# EAGLE board oresat-batteries (EAGLE 9.6.2), part 1 of 2
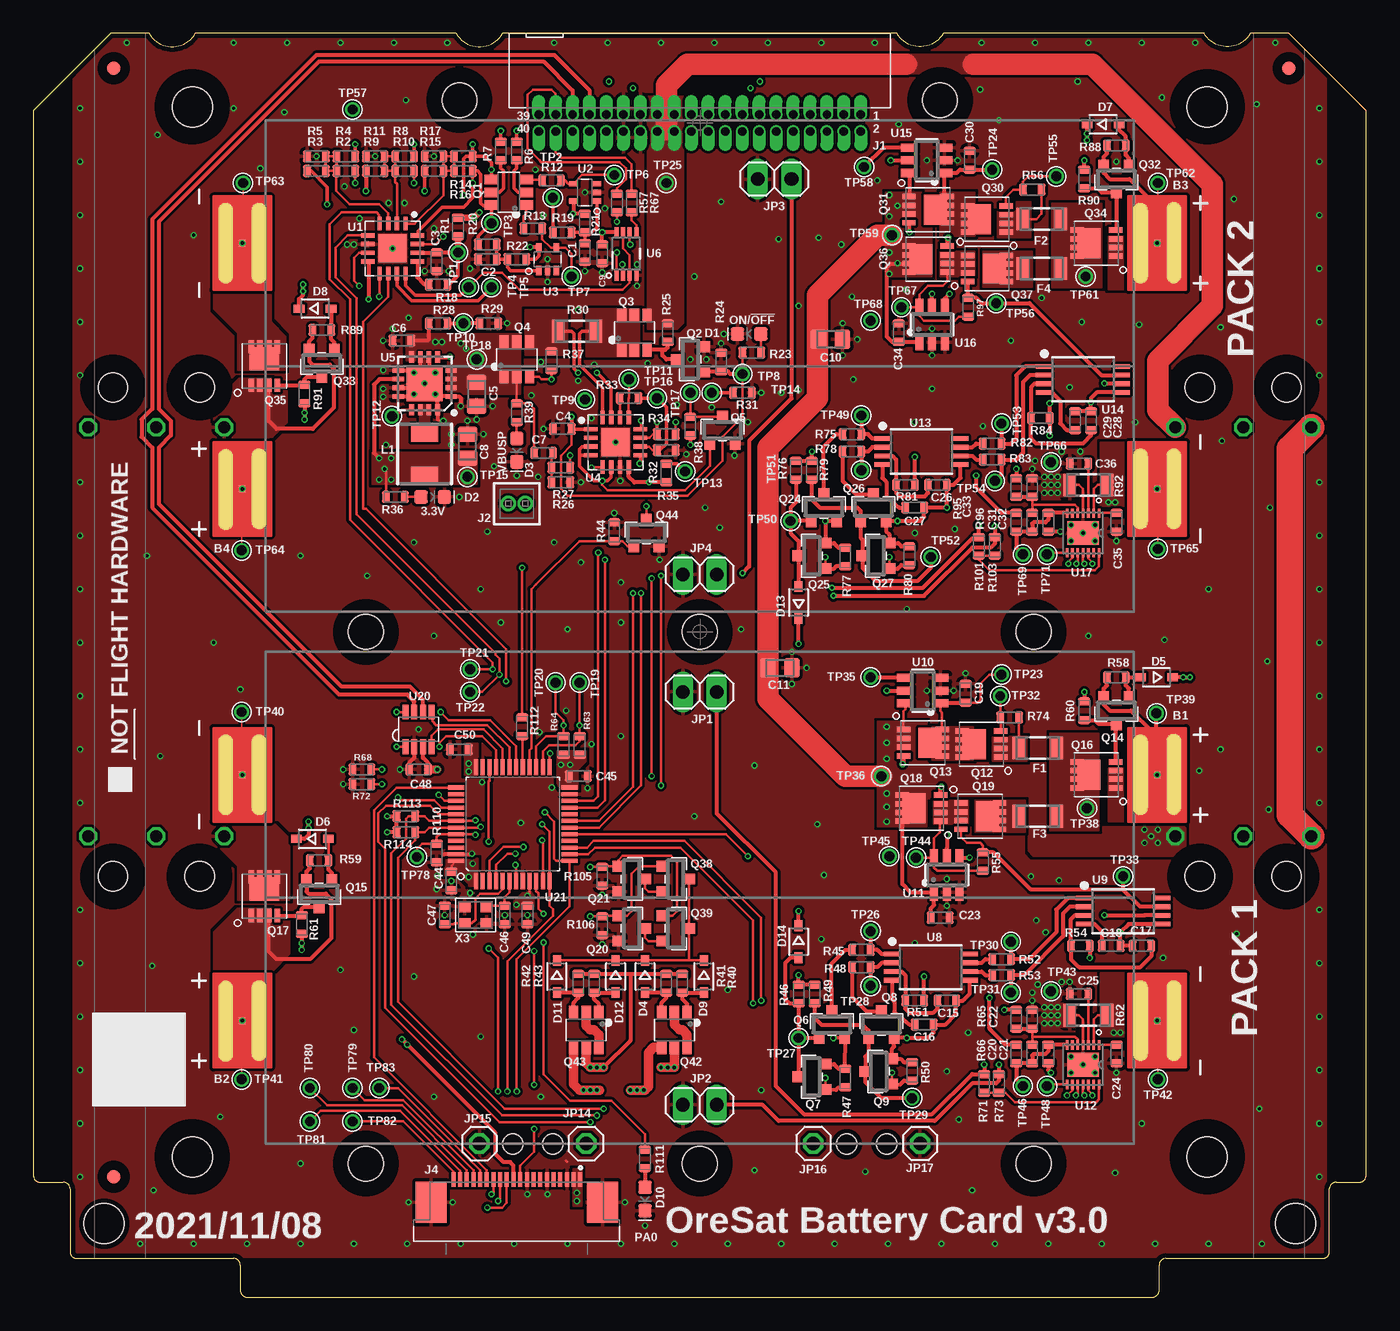
[diagram p5: board, top side]
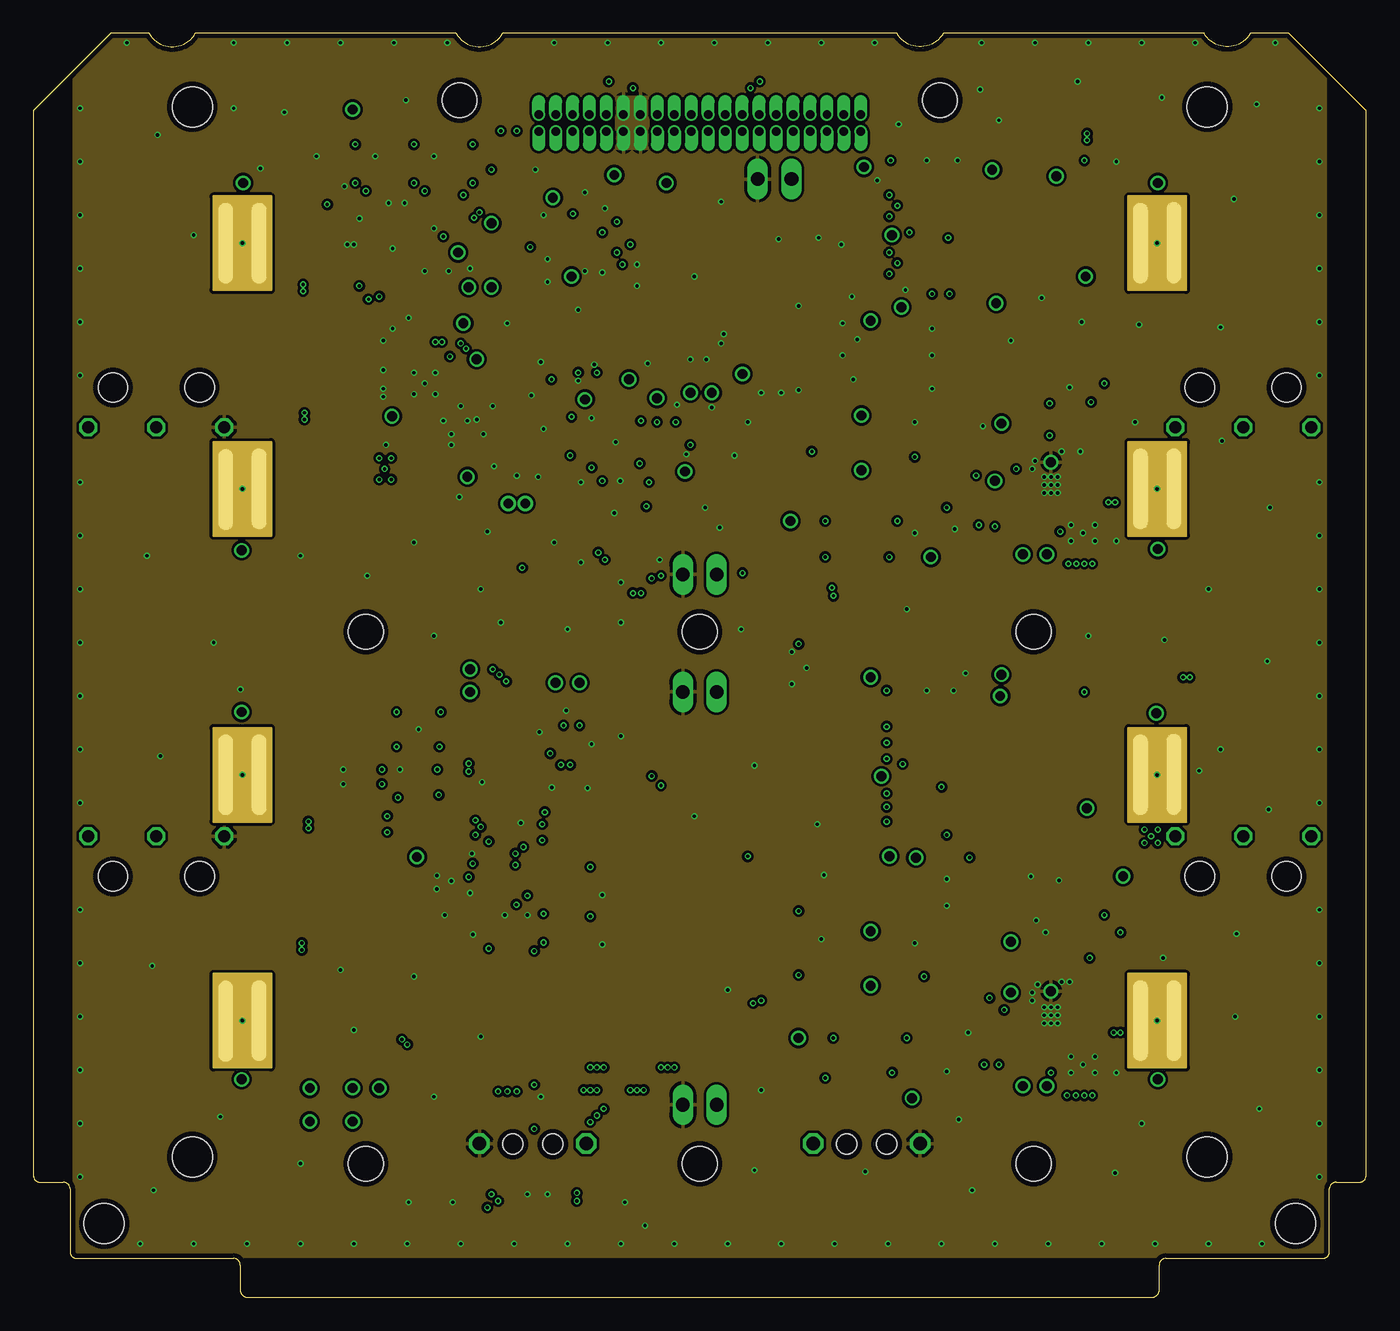
[diagram p6: board, inner layer Route2]
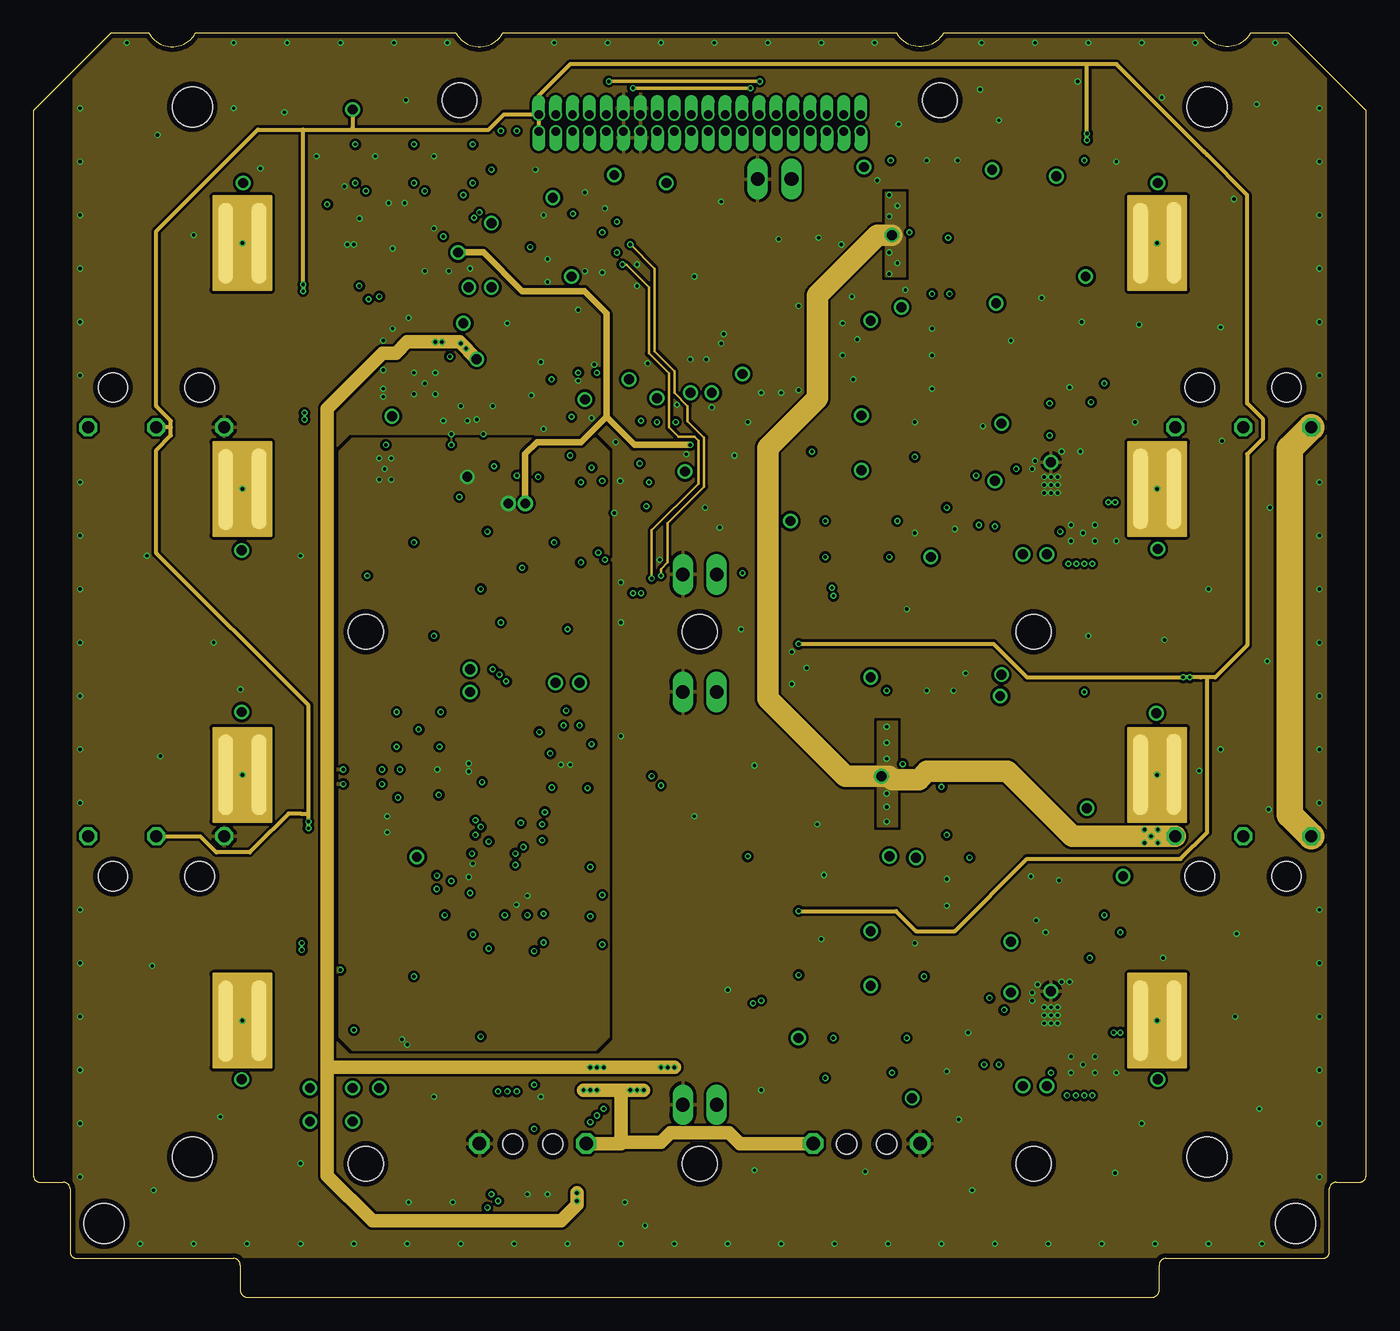
[diagram p7: board, inner layer route15]
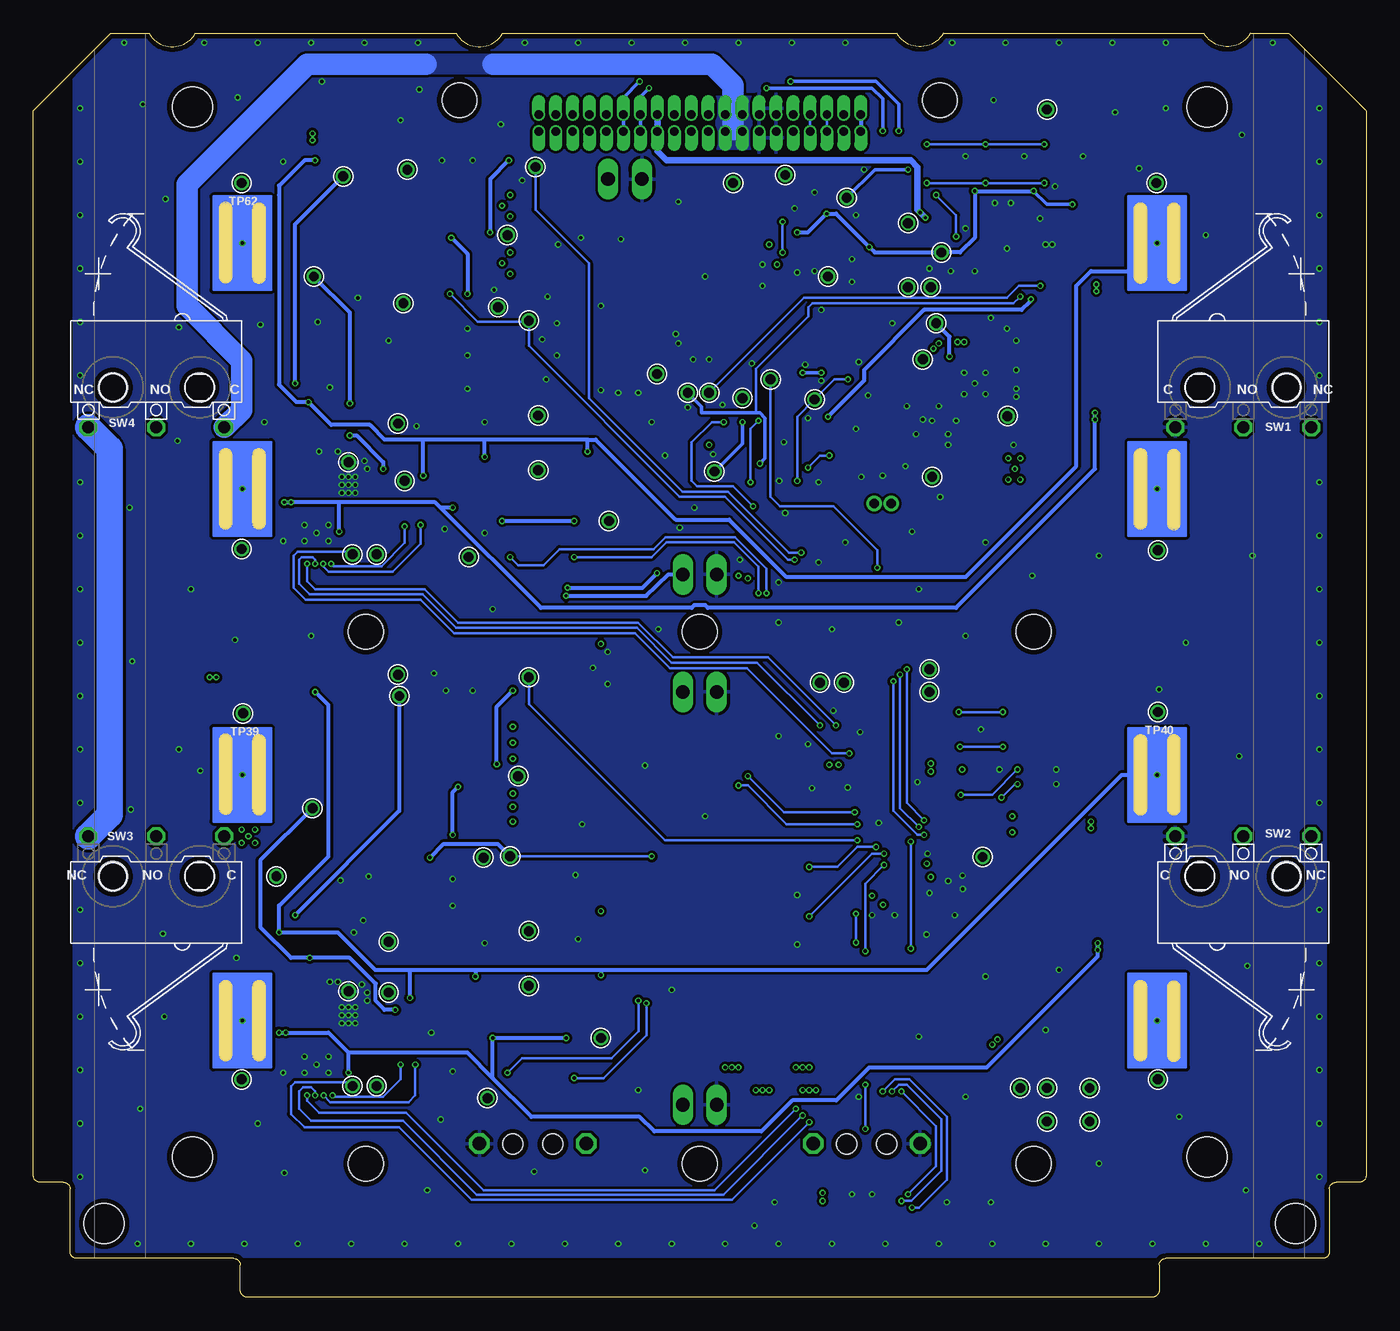
[diagram p8: board, bottom side, seen from below]

Size 99.8 x 94.6 mm. Coordinates in mm from the lower left corner, seen from the top.
Copper layers (1*2*15*16): Top 0.035559375mm / dielectric 0.17018125mm / Route2 0.01778125mm / dielectric 47mil / route15 0.01778125mm / dielectric 0.17018125mm / Bottom 0.035559375mm
Design rules "oshpark-4layer *": minimum track width 5mil, minimum drill 10mil, track to track 5mil, track to pad 5mil, pad to pad 5mil, via to via 5mil, smd to smd 5mil, copper to edge 15mil, drill to drill 6mil, minimum pad ring 4mil, minimum via ring 4mil, stop-mask expansion 2.5mil, vias tented up to drill 10mil, thermal gap 10mil
Net classes: 1 SHUTDOWN: clearance 0.2 mm; 2 BATTERY: clearance 0.2 mm
tRestrict: 8 lines

## Footprints (pad centres in the part's own frame; a part is rotated, then mirrored left to right if it is on the bottom)
18650 = smd 0.5 x 0.5: NEG-T 0,-34.25; POS-T 0,34.25
.0603-C-NOSILK = smd 0.6 x 0.9: 1 -0.7,0; 2 0.7,0
.0805-B-NOSILK = smd 1.15 x 1.45: 1 -0.9,0; 2 0.9,0
LED-0603 = smd 1 x 1: A -0.877,0; C 0.877,0
SOD323-R = smd 0.8 x 0.6: A 1.2,0; C -1.2,0
1206-C = smd 0.95 x 1.7: 1 -1.4,0; 2 1.4,0
FIDUCIAL-1.0X2.0 = smd 1 x 1: FIDUCIAL 0,0
J-SAMTEC-TFM-120-X1-XXX-D-RA = drill 0.635 pad 0.965 offset: 1 12.065,0.635; 2 12.065,-0.635; 3 10.795,0.635; 4 10.795,-0.635; 5 9.525,0.635; 6 9.525,-0.635; 7 8.255,0.635; 8 8.255,-0.635; 9 6.985,0.635; 10 6.985,-0.635; 11 5.715,0.635; 12 5.715,-0.635; 13 4.445,0.635; 14 4.445,-0.635; 15 3.175,0.635; 16 3.175,-0.635; 17 1.905,0.635; 18 1.905,-0.635; 19 0.635,0.635; 20 0.635,-0.635; 21 -0.635,0.635; 22 -0.635,-0.635; 23 -1.905,0.635; 24 -1.905,-0.635; 25 -3.175,0.635; 26 -3.175,-0.635; 27 -4.445,0.635; 28 -4.445,-0.635; 29 -5.715,0.635; 30 -5.715,-0.635; 31 -6.985,0.635; 32 -6.985,-0.635; 33 -8.255,0.635; 34 -8.255,-0.635; 35 -9.525,0.635; 36 -9.525,-0.635; 37 -10.795,0.635; 38 -10.795,-0.635; 39 -12.065,0.635; 40 -12.065,-0.635
SAMTEC-FTS-102-01-X-S = drill 0.71 pad 1.143: 1 -0.635,0; 2 0.635,0
TE_2-1734592-0 = smd 0.3 x 1.1: 1 -4.75,-1.7; 2 -4.25,-1.7; 3 -3.75,-1.7; 4 -3.25,-1.7; 5 -2.75,-1.7; 6 -2.25,-1.7; 7 -1.75,-1.7; 8 -1.25,-1.7; 9 -0.75,-1.7; 10 -0.25,-1.7; 11 0.25,-1.7; 12 0.75,-1.7; 13 1.25,-1.7; 14 1.75,-1.7; 15 2.25,-1.7; 16 2.75,-1.7; 17 3.25,-1.7; 18 3.75,-1.7; 19 4.25,-1.7; 20 4.75,-1.7 | smd 2.3 x 3.1: PAD1 6.42,0; PAD2 -6.42,0
1X02 = drill 1.016 long: 1 -1.27,0; 2 1.27,0
1X01 = drill 1.016 octagon: 1 0,0
ECS-MPI4040 = smd 2 x 1.3: 1 0,1.575; 2 0,-1.575
SOT23-6 = smd 0.7 x 1: 1 -0.95,-1.3; 2 0,-1.3; 3 0.95,-1.3; 4 0.95,1.3; 5 0,1.3; 6 -0.95,1.3
SOT23-3 = smd 0.8 x 0.9: 1 -0.95,-1; 2 0.95,-1; 3 0,1
POWERPAK-1212-8 = smd 0.41 x 1: 1 -0.975,-1.44; 2 -0.325,-1.44; 3 0.325,-1.44; 4 0.975,-1.44; 5 -0.975,1.44; 6 -0.325,1.44; 7 0.325,1.44; 8 0.975,1.44 | smd 2.24 x 1.73: PAD 0,0.55
D2F-L3-D-HORIZONTAL-L = drill 0.9 octagon: C -5.1,-3; NC 5.1,-3; NO 0,-3 | hole 2.2: 3.25,0; -3.25,0
D2F-L3-D-HORIZONTAL-R = drill 0.9 octagon: C 5.1,-3; NC -5.1,-3; NO 0,-3 | hole 2.2: 3.25,0; -3.25,0
1X01' = drill 0.737 pad 1.1: 1 0,0
QFN65P400X400X80-17T210 = smd 1.01 x 0.32: 1 -1.86,0.975; 2 -1.86,0.325; 3 -1.86,-0.325; 4 -1.86,-0.975; 9 1.86,-0.975; 10 1.86,-0.325; 11 1.86,0.325; 12 1.86,0.975 | smd 0.32 x 1.01: 5 -0.975,-1.86; 6 -0.325,-1.86; 7 0.325,-1.86; 8 0.975,-1.86; 13 0.975,1.86; 14 0.325,1.86; 15 -0.325,1.86; 16 -0.975,1.86 | smd 2.1 x 2.1: EPAD 0,0
SC70-5 = smd 0.4 x 0.7: 1 -0.65,-0.85; 2 0,-0.85; 3 0.65,-0.85; 4 0.65,0.85; 5 -0.65,0.85
S-PVQFN-16 = smd 0.85 x 0.35: 1 -1.975,0.975; 2 -1.975,0.325; 3 -1.975,-0.325; 4 -1.975,-0.975; 9 1.975,-0.975; 10 1.975,-0.325; 11 1.975,0.325; 12 1.975,0.975 | smd 0.35 x 0.85: 5 -0.975,-1.975; 6 -0.325,-1.975; 7 0.325,-1.975; 8 0.975,-1.975; 13 0.975,1.975; 14 0.325,1.975; 15 -0.325,1.975; 16 -0.975,1.975 | smd 2.7 x 2.7: PAD 0,0
DCU0008A_N = smd 0.8 x 0.3: 1 -1.6,0.75; 2 -1.6,0.25; 3 -1.6,-0.25; 4 -1.6,-0.75; 5 1.6,-0.75; 6 1.6,-0.25; 7 1.6,0.25; 8 1.6,0.75
TSSOP8 = smd 1.2 x 0.35: 1 -2.925,0.975; 2 -2.925,0.325; 3 -2.925,-0.325; 4 -2.925,-0.975; 5 2.925,-0.975; 6 2.925,-0.325; 7 2.925,0.325; 8 2.925,0.975
SOT23-6' = smd 0.6 x 1.25: 1 0.95,1.31; 2 0,1.31; 3 -0.95,1.31; 4 -0.95,-1.31; 5 0,-1.31; 6 0.95,-1.31
21-0137I_T1433-2 = smd 0.7 x 0.2: 1 -1.475,1.2; 2 -1.475,0.8; 3 -1.475,0.4; 4 -1.475,0; 5 -1.475,-0.4; 6 -1.475,-0.8; 7 -1.475,-1.2; 8 1.475,-1.2; 9 1.475,-0.8; 10 1.475,-0.4; 11 1.475,0; 12 1.475,0.4; 13 1.475,0.8; 14 1.475,1.2 | smd 1.78 x 2.35: EP 0,0
SOT23-8_TI-DCN = smd 0.45 x 1.1: 1 -0.975,-1.3; 2 -0.325,-1.3; 3 0.325,-1.3; 4 0.975,-1.3; 5 0.975,1.3; 6 0.325,1.3; 7 -0.325,1.3; 8 -0.975,1.3
STM32F091C = smd 0.3 x 1.2: 1 -2.75,-4.25; 2 -2.25,-4.25; 3 -1.75,-4.25; 4 -1.25,-4.25; 5 -0.75,-4.25; 6 -0.25,-4.25; 7 0.25,-4.25; 8 0.75,-4.25; 9 1.25,-4.25; 10 1.75,-4.25; 11 2.25,-4.25; 12 2.75,-4.25; 25 2.75,4.25; 26 2.25,4.25; 27 1.75,4.25; 28 1.25,4.25; 29 0.75,4.25; 30 0.25,4.25; 31 -0.25,4.25; 32 -0.75,4.25; 33 -1.25,4.25; 34 -1.75,4.25; 35 -2.25,4.25; 36 -2.75,4.25 | smd 1.2 x 0.3: 13 4.25,-2.75; 14 4.25,-2.25; 15 4.25,-1.75; 16 4.25,-1.25; 17 4.25,-0.75; 18 4.25,-0.25; 19 4.25,0.25; 20 4.25,0.75; 21 4.25,1.25; 22 4.25,1.75; 23 4.25,2.25; 24 4.25,2.75; 37 -4.25,2.75; 38 -4.25,2.25; 39 -4.25,1.75; 40 -4.25,1.25; 41 -4.25,0.75; 42 -4.25,0.25; 43 -4.25,-0.25; 44 -4.25,-0.75; 45 -4.25,-1.25; 46 -4.25,-1.75; 47 -4.25,-2.25; 48 -4.25,-2.75
ORESAT-CARD-V1.3-BATTERY-V3.0 = hole 2.6: 31.9,89.6; 67.9,89.6; 49.9,49.8; 24.9,49.8; 74.9,49.8; 74.9,10; 49.9,10; 24.9,10 | hole 1.5: 35.9,11.45; 38.9,11.45; 60.9,11.45; 63.9,11.45 | hole 3: 94.5,5.5; 5.3,5.5; 87.9,10.5; 87.9,89.1; 11.9,89.1; 11.9,10.5
CRYSTAL_2.5X2 = smd 0.9 x 0.8: 1 -0.825,-0.625; 2 0.825,-0.625; 3 0.825,0.625; 4 -0.825,0.625

## Placement (x,y rotation side)
B1  B-18650-LI-BATTERY  [18650]  49.9,39.1 270 top
B2  B-18650-LI-BATTERY  [18650]  49.9,20.7 90 top
B3  B-18650-LI-BATTERY  [18650]  49.9,78.9 270 top
B4  B-18650-LI-BATTERY  [18650]  49.9,60.5 90 top
C1  1u  [.0603-C-NOSILK]  41.3,78.2 270 top
C2  1u  [.0603-C-NOSILK]  34,77.7 180 top
C3  100n  [.0603-C-NOSILK]  30.2,77.5 90 top
C4  1u  [.0603-C-NOSILK]  39.6,65 180 top
C5  10u  [.0805-B-NOSILK]  33.2,67.6 270 top
C6  1u  [.0603-C-NOSILK]  27.6,71.6 180 top
C7  1u  [.0603-C-NOSILK]  38.2,63.2 180 top
C8  22u  [.0805-B-NOSILK]  32.5,63.7 90 top
C9  100n  [.0603-C-NOSILK]  42.6,78.1 90 top
C10  10u  [.0805-B-NOSILK]  59.7,71.7 0 top
C11  10u  [.0805-B-NOSILK]  55.9,47.1 0 top
C15  100n  [.0603-C-NOSILK]  68.4,22.2 0 top
C16  10n  [.0603-C-NOSILK]  66.7,20.4 0 top
C17  100n  [.0603-C-NOSILK]  83,26.3 180 top
C18  10n  [.0603-C-NOSILK]  80.7,26.3 0 top
C19  100n  [.0603-C-NOSILK]  69.8,45.2 90 top
C20  1n  [.0603-C-NOSILK]  74.8,18.2 270 top
C21  1n  [.0603-C-NOSILK]  76,18.2 270 top
C22  100n  [.0603-C-NOSILK]  74.8,20.8 90 top
C23  100n  [.0603-C-NOSILK]  67.9,28.4 0 top
C24  470n  [.0603-C-NOSILK]  81.1,18.2 270 top
C25  470n  [.0603-C-NOSILK]  78.3,22.7 180 top
C26  100n  [.0603-C-NOSILK]  67.7,60.8 0 top
C27  10n  [.0603-C-NOSILK]  66,59.1 0 top
C28  100n  [.0603-C-NOSILK]  79.2,65.6 90 top
C29  10n  [.0603-C-NOSILK]  78,65.6 90 top
C30  100n  [.0603-C-NOSILK]  70.1,85.1 90 top
C31  1n  [.0603-C-NOSILK]  74.8,58 270 top
C32  1n  [.0603-C-NOSILK]  76,58 270 top
C33  100n  [.0603-C-NOSILK]  74.8,60.6 90 top
C34  100n  [.0603-C-NOSILK]  64.8,72.2 90 top
C35  470n  [.0603-C-NOSILK]  81.1,58 270 top
C36  470n  [.0603-C-NOSILK]  78.3,62.4 180 top
C44  100n  [.0603-C-NOSILK]  31.3,31.15 90 top
C45  100n  [.0603-C-NOSILK]  40.8,39 180 top
C46  20p  [.0603-C-NOSILK]  35.3,28.6 270 top
C47  20p  [.0603-C-NOSILK]  30.8,28.6 90 top
C48  100n  [.0603-C-NOSILK]  28.85,39.5 0 top
C49  100n  [.0603-C-NOSILK]  37,28.6 90 top
C50  100n  [.0603-C-NOSILK]  31.9,41 0 top
D1  GREEN  [LED-0603]  53.6,72.1 180 top
D2  GREEN  [LED-0603]  29.9,59.9 0 top
D3  GREEN  [LED-0603]  36.2,63.4 270 top
D4  1N4151WS  [SOD323-R]  45.8,24 270 top
D5  1N4151WS  [SOD323-R]  84.1,46.4 180 top
D6  1N4151WS  [SOD323-R]  20.9,34.3 0 top
D7  1N4151WS  [SOD323-R]  80.1,87.8 0 top
D8  1N4151WS  [SOD323-R]  21.1,74 0 top
D9  1N4151WS  [SOD323-R]  50.2,24 270 top
D10  AMBER  [LED-0603]  45.8,7.35 270 top
D11  1N4151WS  [SOD323-R]  39.2,24 270 top
D12  1N4151WS  [SOD323-R]  43.6,24 270 top
D13  1N4151WS  [SOD323-R]  57.3,52 90 top
D14  1N4151WS  [SOD323-R]  57.3,26.6 270 top
F1  1206L500/12SLPR  [1206-C]  75.2,41.1 0 top
F2  1206L500/12SLPR  [1206-C]  75.5,80.7 0 top
F3  1206L150/12SLYR  [1206-C]  75.2,36 0 top
F4  1206L150/12SLYR  [1206-C]  75.5,77 0 top
FIDUCIAL1  FIDUCIAL-1.0X2.0  [FIDUCIAL-1.0X2.0]  94,92 0 top
FIDUCIAL2  FIDUCIAL-1.0X2.0  [FIDUCIAL-1.0X2.0]  6,92 0 top
FIDUCIAL3  FIDUCIAL-1.0X2.0  [FIDUCIAL-1.0X2.0]  6,9 0 top
J1  J-SAMTEC-TFM-120-X1-XXX-D-RA  [J-SAMTEC-TFM-120-X1-XXX-D-RA]  49.9,87.89 0 top
J2  FTS-102-01-X-SJ  [SAMTEC-FTS-102-01-X-S]  36.2,59.4 0 top
J4  ORESAT-DEBUG-CONNECTOR-ALL  [TE_2-1734592-0]  36.2,7.1 180 top
JP1  [1X02]  49.9,45.3 180 top
JP2  [1X02]  49.9,14.4 180 top
JP3  [1X02]  55.5,83.7 180 top
JP4  [1X02]  49.9,54.1 180 top
JP14  [1X01]  41.4,11.5 90 top
JP15  [1X01]  33.4,11.5 90 top
JP16  [1X01]  58.4,11.5 0 top
JP17  [1X01]  66.4,11.5 0 top
L1  6.8u  [ECS-MPI4040]  29.3,63.1 0 top
Q1  DMP2240UDM  [SOT23-6]  35.6,82.7 90 top
Q2  PMV45EN  [SOT23-3]  49.2,70.2 90 top
Q3  DMP3050LVT-7  [SOT23-6]  45,72.2 0 top
Q4  DMP3050LVT-7  [SOT23-6]  36.2,70.2 0 top
Q5  PMV45EN  [SOT23-3]  51.6,64.9 0 top
Q6  PM45VEN  [SOT23-3]  59.8,20.4 0 top
Q7  PM45VEN  [SOT23-3]  58.3,16.5 90 top
Q8  PM45VEN  [SOT23-3]  63.5,20.4 0 top
Q9  PM45VEN  [SOT23-3]  63.3,16.9 90 top
Q12  Si7625DN  [POWERPAK-1212-8]  71,41.4 90 top
Q13  Si7625DN  [POWERPAK-1212-8]  66.6,41.5 270 top
Q14  NTR4101  [SOT23-3]  81.1,43.9 180 top
Q15  NTR4101  [SOT23-3]  21.4,30.2 180 top
Q16  Si7625DN  [POWERPAK-1212-8]  79.6,39.1 90 top
Q17  Si7625DN  [POWERPAK-1212-8]  17.3,30 0 top
Q18  Si7625DN  [POWERPAK-1212-8]  66.5,36.6 90 top
Q19  Si7625DN  [POWERPAK-1212-8]  70.9,36 270 top
Q20  PMV45EN  [SOT23-3]  44.8,27.6 270 top
Q21  PMV45EN  [SOT23-3]  44.8,31.3 270 top
Q24  PM45VEN  [SOT23-3]  59.2,59.1 0 top
Q25  PM45VEN  [SOT23-3]  58.3,55.5 90 top
Q26  PM45VEN  [SOT23-3]  62.9,59.1 0 top
Q27  PM45VEN  [SOT23-3]  63.1,55.5 90 top
Q30  Si7625DN  [POWERPAK-1212-8]  71.4,80.7 90 top
Q31  Si7625DN  [POWERPAK-1212-8]  67,81.4 270 top
Q32  NTR4101  [SOT23-3]  81.1,83.7 180 top
Q33  NTR4101  [SOT23-3]  21.6,69.9 180 top
Q34  Si7625DN  [POWERPAK-1212-8]  79.6,78.9 90 top
Q35  Si7625DN  [POWERPAK-1212-8]  17.3,69.7 0 top
Q36  Si7625DN  [POWERPAK-1212-8]  67,77.7 90 top
Q37  Si7625DN  [POWERPAK-1212-8]  71.4,77 270 top
Q38  PMV45EN  [SOT23-3]  48.1,31.3 270 top
Q39  PMV45EN  [SOT23-3]  48.1,27.6 270 top
Q42  DMP2240UDM  [SOT23-6]  48,20 180 top
Q43  DMP2240UDM  [SOT23-6]  41.4,20 180 top
Q44  PMV45EN  [SOT23-3]  45.9,57.2 0 top
R1  10  [.0603-C-NOSILK]  31.8,80.1 270 top
R2  NP  [.0603-C-NOSILK]  23.4,85.4 180 top
R3  NP  [.0603-C-NOSILK]  21.2,84.3 180 top
R4  NP  [.0603-C-NOSILK]  23.4,84.3 0 top
R5  10k  [.0603-C-NOSILK]  21.2,85.4 0 top
R6  100  [.0603-C-NOSILK]  36.2,85.8 270 top
R7  100  [.0603-C-NOSILK]  35,85.8 270 top
R8  NP  [.0603-C-NOSILK]  27.8,85.4 180 top
R9  NP  [.0603-C-NOSILK]  25.6,84.3 180 top
R10  NP  [.0603-C-NOSILK]  27.8,84.3 0 top
R11  10k  [.0603-C-NOSILK]  25.6,85.4 0 top
R12  665k  [.0603-C-NOSILK]  38.8,83.6 180 top
R13  665k  [.0603-C-NOSILK]  37.4,80 180 top
R14  NP  [.0603-C-NOSILK]  32.2,85.4 180 top
R15  NP  [.0603-C-NOSILK]  30,84.3 180 top
R16  NP  [.0603-C-NOSILK]  32.2,84.3 0 top
R17  10k  [.0603-C-NOSILK]  30,85.4 0 top
R18  10k  [.0603-C-NOSILK]  30.3,75.8 0 top
R19  330k  [.0603-C-NOSILK]  39.6,79.7 180 top
R20  330k  [.0603-C-NOSILK]  34,78.8 180 top
R21  1M  [.0603-C-NOSILK]  41.3,80.4 90 top
R22  1M  [.0603-C-NOSILK]  36.2,77.7 0 top
R23  2.7k  [.0603-C-NOSILK]  53.8,70.7 180 top
R24  10k  [.0603-C-NOSILK]  51.5,70 270 top
R25  10k  [.0603-C-NOSILK]  47.5,72.2 90 top
R26  100k  [.0603-C-NOSILK]  39.5,61 180 top
R27  10k  [.0603-C-NOSILK]  39.5,62.1 180 top
R28  10k  [.0603-C-NOSILK]  30.3,72.9 180 top
R29  NP  [.0603-C-NOSILK]  34.1,72.9 180 top
R30  100m  [1206-C]  40.7,72.3 180 top
R31  10k  [.0603-C-NOSILK]  53.1,67.7 180 top
R32  10k  [.0603-C-NOSILK]  47.4,61.7 270 top
R33  0  [.0603-C-NOSILK]  44.6,67.3 180 top
R34  20k  [.0603-C-NOSILK]  47.4,64.6 180 top
R35  NP  [.0603-C-NOSILK]  47.4,63.4 180 top
R36  2.7k  [.0603-C-NOSILK]  27.1,59.9 180 top
R37  10k  [.0603-C-NOSILK]  38.8,70.1 90 top
R38  10k  [.0603-C-NOSILK]  49.2,65.2 270 top
R39  2.7k  [.0603-C-NOSILK]  36.2,66.2 90 top
R40  10k  [.0603-C-NOSILK]  48.6,23.5 270 top
R41  10k  [.0603-C-NOSILK]  47.4,23.5 270 top
R42  10k  [.0603-C-NOSILK]  40.8,23.5 270 top
R43  10k  [.0603-C-NOSILK]  42,23.5 270 top
R44  10k  [.0603-C-NOSILK]  43.5,57.3 270 top
R45  1k  [.0603-C-NOSILK]  62,26 0 top
R46  100k  [.0603-C-NOSILK]  57.3,22.7 90 top
R47  100k  [.0603-C-NOSILK]  60.8,16.4 270 top
R48  1k  [.0603-C-NOSILK]  62,24.7 0 top
R49  100k  [.0603-C-NOSILK]  58.5,22.7 270 top
R50  100k  [.0603-C-NOSILK]  65.8,16.9 270 top
R51  470  [.0603-C-NOSILK]  66,22.2 0 top
R52  1k  [.0603-C-NOSILK]  72.5,25.3 0 top
R53  1k  [.0603-C-NOSILK]  72.5,24.1 0 top
R54  470  [.0603-C-NOSILK]  78.4,26.3 0 top
R55  100k  [.0603-C-NOSILK]  71.1,32.6 270 top
R56  100k  [.0603-C-NOSILK]  74.8,82.9 0 top
R57  10k  [.0603-C-NOSILK]  43.7,81.9 90 top
R58  100k  [.0603-C-NOSILK]  81.1,46.4 180 top
R59  100k  [.0603-C-NOSILK]  21.4,32.7 0 top
R60  100k  [.0603-C-NOSILK]  78.7,43.9 90 top
R61  100k  [.0603-C-NOSILK]  20.1,27.9 270 top
R62  10m  [1206-C]  79,21.1 180 top
R63  4.7k  [.0603-C-NOSILK]  40.9,41.3 270 top
R64  4.7k  [.0603-C-NOSILK]  39.7,41.3 270 top
R65  10  [.0603-C-NOSILK]  73.6,20.8 90 top
R66  100  [.0603-C-NOSILK]  73.6,18.2 270 top
R67  10k  [.0603-C-NOSILK]  44.8,81.9 90 top
R68  10k  [.0603-C-NOSILK]  24.6,39.5 180 top
R71  10k  [.0603-C-NOSILK]  71.2,16 270 top
R72  10k  [.0603-C-NOSILK]  24.6,38.4 180 top
R73  10k  [.0603-C-NOSILK]  72.3,16 270 top
R74  100k  [.0603-C-NOSILK]  73.1,43.4 180 top
R75  1k  [.0603-C-NOSILK]  61.3,64.6 0 top
R76  100k  [.0603-C-NOSILK]  57.1,61.9 90 top
R77  100k  [.0603-C-NOSILK]  60.8,55.4 270 top
R78  1k  [.0603-C-NOSILK]  61.3,63.3 0 top
R79  100k  [.0603-C-NOSILK]  58.3,61.9 270 top
R80  100k  [.0603-C-NOSILK]  65.6,55.5 270 top
R81  470  [.0603-C-NOSILK]  65.3,60.8 0 top
R82  1k  [.0603-C-NOSILK]  71.8,63.9 0 top
R83  1k  [.0603-C-NOSILK]  71.8,62.7 0 top
R84  470  [.0603-C-NOSILK]  75.4,65.8 0 top
R88  100k  [.0603-C-NOSILK]  81.1,86.2 180 top
R89  100k  [.0603-C-NOSILK]  21.6,72.4 0 top
R90  100k  [.0603-C-NOSILK]  78.7,83.7 90 top
R91  100k  [.0603-C-NOSILK]  20.3,67.6 270 top
R92  10m  [1206-C]  79,60.8 180 top
R95  10  [.0603-C-NOSILK]  73.6,60.6 90 top
R96  100  [.0603-C-NOSILK]  73.6,58 270 top
R97  100k  [.0603-C-NOSILK]  70,74.1 270 top
R101  10k  [.0603-C-NOSILK]  70.8,56.2 270 top
R103  10k  [.0603-C-NOSILK]  72,56.2 270 top
R105  10k  [.0603-C-NOSILK]  42.6,31.5 270 top
R106  10k  [.0603-C-NOSILK]  42.6,27.8 270 top
R110  10k  [.0603-C-NOSILK]  30.2,33.25 90 top
R111  2.7k  [.0603-C-NOSILK]  45.8,10.35 90 top
R112  10k  [.0603-C-NOSILK]  36.6,42.7 270 top
R113  4.7k  [.0603-C-NOSILK]  27.9,36 180 top
R114  4.7k  [.0603-C-NOSILK]  27.9,34.8 180 top
SW1  OMRON-D2F-5L3-LEFT  [D2F-L3-D-HORIZONTAL-L]  9.2,68.1 0 bottom
SW2  OMRON-D2F-5L3-RIGHT  [D2F-L3-D-HORIZONTAL-R]  9.2,31.5 180 bottom
SW3  OMRON-D2F-5L3-LEFT  [D2F-L3-D-HORIZONTAL-L]  90.6,31.5 180 bottom
SW4  OMRON-D2F-5L3-RIGHT  [D2F-L3-D-HORIZONTAL-R]  90.6,68.1 0 bottom
TP1  TEST-POINT-LARGE-SQUARE  [1X01']  31.8,78.2 0 top
TP2  TEST-POINT-LARGE-SQUARE  [1X01']  38.9,82.3 0 top
TP3  TEST-POINT-LARGE-SQUARE  [1X01']  34.3,80.4 0 top
TP4  TEST-POINT-LARGE-SQUARE  [1X01']  32.6,75.6 0 top
TP5  TEST-POINT-LARGE-SQUARE  [1X01']  34.3,75.6 0 top
TP6  TEST-POINT-LARGE-SQUARE  [1X01']  43.5,84 0 top
TP7  TEST-POINT-LARGE-SQUARE  [1X01']  40.3,76.4 0 top
TP8  TEST-POINT-LARGE-SQUARE  [1X01']  53.1,69.1 90 top
TP9  TEST-POINT-LARGE-SQUARE  [1X01']  41.3,67.2 0 top
TP10  TEST-POINT-LARGE-SQUARE  [1X01']  32.2,72.9 0 top
TP11  TEST-POINT-LARGE-SQUARE  [1X01']  44.6,68.7 0 top
TP12  TEST-POINT-LARGE-SQUARE  [1X01']  26.85,65.95 180 top
TP13  TEST-POINT-LARGE-SQUARE  [1X01']  48.8,61.8 0 top
TP14  TEST-POINT-LARGE-SQUARE  [1X01']  50.8,67.7 0 top
TP15  TEST-POINT-LARGE-SQUARE  [1X01']  32.5,61.4 180 top
TP16  TEST-POINT-LARGE-SQUARE  [1X01']  46.7,67.3 0 top
TP17  TEST-POINT-LARGE-SQUARE  [1X01']  49.2,67.7 0 top
TP18  TEST-POINT-LARGE-SQUARE  [1X01']  33.2,70.2 0 top
TP19  TEST-POINT-LARGE-SQUARE  [1X01']  40.9,46 0 top
TP20  TEST-POINT-LARGE-SQUARE  [1X01']  39.1,46 0 top
TP21  TEST-POINT-LARGE-SQUARE  [1X01']  32.7,47 90 top
TP22  TEST-POINT-LARGE-SQUARE  [1X01']  32.7,45.3 90 top
TP23  TEST-POINT-LARGE-SQUARE  [1X01']  72.5,46.6 0 top
TP24  TEST-POINT-LARGE-SQUARE  [1X01']  71.8,84.4 0 top
TP25  TEST-POINT-LARGE-SQUARE  [1X01']  47.4,83.4 0 top
TP26  TEST-POINT-LARGE-SQUARE  [1X01']  62.7,27.4 180 top
TP27  TEST-POINT-LARGE-SQUARE  [1X01']  57.3,19.4 90 top
TP28  TEST-POINT-LARGE-SQUARE  [1X01']  62.7,23.3 0 top
TP29  TEST-POINT-LARGE-SQUARE  [1X01']  65.8,14.9 0 top
TP30  TEST-POINT-LARGE-SQUARE  [1X01']  73.2,26.6 0 top
TP31  TEST-POINT-LARGE-SQUARE  [1X01']  73.2,22.8 0 top
TP32  TEST-POINT-LARGE-SQUARE  [1X01']  72.4,45 180 top
TP33  TEST-POINT-LARGE-SQUARE  [1X01']  81.6,31.5 180 top
TP35  TEST-POINT-LARGE-SQUARE  [1X01']  62.7,46.4 180 top
TP36  TEST-POINT-LARGE-SQUARE  [1X01']  63.5,39 180 top
TP38  TEST-POINT-LARGE-SQUARE  [1X01']  78.9,36.6 0 top
TP39  TEST-POINT-LARGE-SQUARE  [1X01']  84.1,43.7 0 top
TP40  TEST-POINT-LARGE-SQUARE  [1X01']  15.6,43.8 0 top
TP41  TEST-POINT-LARGE-SQUARE  [1X01']  15.6,16.3 90 top
TP42  TEST-POINT-LARGE-SQUARE  [1X01']  84.2,16.3 0 top
TP43  TEST-POINT-LARGE-SQUARE  [1X01']  76.2,22.9 180 top
TP44  TEST-POINT-LARGE-SQUARE  [1X01']  66.1,32.9 90 top
TP45  TEST-POINT-LARGE-SQUARE  [1X01']  64.1,33 0 top
TP46  TEST-POINT-LARGE-SQUARE  [1X01']  74.1,15.8 0 top
TP48  TEST-POINT-LARGE-SQUARE  [1X01']  75.9,15.8 0 top
TP49  TEST-POINT-LARGE-SQUARE  [1X01']  62,66 180 top
TP50  TEST-POINT-LARGE-SQUARE  [1X01']  56.7,58.1 90 top
TP51  TEST-POINT-LARGE-SQUARE  [1X01']  62,61.9 0 top
TP52  TEST-POINT-LARGE-SQUARE  [1X01']  67.2,55.4 0 top
TP53  TEST-POINT-LARGE-SQUARE  [1X01']  72.5,65.4 0 top
TP54  TEST-POINT-LARGE-SQUARE  [1X01']  72,61.1 0 top
TP55  TEST-POINT-LARGE-SQUARE  [1X01']  76.6,83.9 180 top
TP56  TEST-POINT-LARGE-SQUARE  [1X01']  72.1,74.4 180 top
TP57  TEST-POINT-LARGE-SQUARE  [1X01']  23.9,88.9 180 top
TP58  TEST-POINT-LARGE-SQUARE  [1X01']  62.2,84.6 180 top
TP59  TEST-POINT-LARGE-SQUARE  [1X01']  64.3,79.5 180 top
TP61  TEST-POINT-LARGE-SQUARE  [1X01']  78.8,76.4 0 top
TP62  TEST-POINT-LARGE-SQUARE  [1X01']  84.2,83.4 0 top
TP63  TEST-POINT-LARGE-SQUARE  [1X01']  15.7,83.4 180 top
TP64  TEST-POINT-LARGE-SQUARE  [1X01']  15.6,55.9 0 top
TP65  TEST-POINT-LARGE-SQUARE  [1X01']  84.2,56 0 top
TP66  TEST-POINT-LARGE-SQUARE  [1X01']  76.2,62.5 90 top
TP67  TEST-POINT-LARGE-SQUARE  [1X01']  65,74.1 90 top
TP68  TEST-POINT-LARGE-SQUARE  [1X01']  62.7,73.1 0 top
TP69  TEST-POINT-LARGE-SQUARE  [1X01']  74.1,55.6 0 top
TP71  TEST-POINT-LARGE-SQUARE  [1X01']  75.9,55.6 0 top
TP78  TEST-POINT-LARGE-SQUARE  [1X01']  28.72,32.95 270 top
TP79  TEST-POINT-LARGE-SQUARE  [1X01']  23.9,15.65 0 top
TP80  TEST-POINT-LARGE-SQUARE  [1X01']  20.7,15.65 0 top
TP81  TEST-POINT-LARGE-SQUARE  [1X01']  20.7,13.15 0 top
TP82  TEST-POINT-LARGE-SQUARE  [1X01']  23.9,13.15 0 top
TP83  TEST-POINT-LARGE-SQUARE  [1X01']  25.9,15.65 0 top
U1  MAX7310ATE  [QFN65P400X400X80-17T210]  26.9,78.5 270 top
U2  MIC842LYC5  [SC70-5]  41.3,82.7 90 top
U3  MIC842LYC5  [SC70-5]  38.5,77.7 0 top
U4  MAX4211FETE  [QFN65P400X400X80-17T210]  43.6,64 0 top
U5  TPS62111RSA  [S-PVQFN-16]  29.3,68.4 180 top
U6  TS5A21366DCUR  [DCU0008A_N]  44.4,78.1 90 top
U8  S-8209AAA-T8T1U  [TSSOP8]  67.2,24.7 0 top
U9  S-8209AAA-T8T1U  [TSSOP8]  81.6,28.9 0 top
U10  LTC4412  [SOT23-6']  66.6,45.4 270 top
U11  LTC4412  [SOT23-6']  68.4,31.6 180 top
U12  MAX17205G  [21-0137I_T1433-2]  78.6,17.4 270 top
U13  S-8209AAA-T8T1U  [TSSOP8]  66.5,63.3 0 top
U14  S-8209AAA-T8T1U  [TSSOP8]  78.6,68.7 0 top
U15  LTC4412  [SOT23-6']  66.9,85.1 270 top
U16  LTC4412  [SOT23-6']  67.3,72.8 180 top
U17  MAX17205G  [21-0137I_T1433-2]  78.6,57.2 270 top
U20  TCAN330  [SOT23-8_TI-DCN]  28.85,42.5 0 top
U21  STM32F091C  [STM32F091C]  35.9,35.4 0 top
U$1  FLIGHMARKERNEW  [FLIGHTMARKER_NEW_BOARDS]  7.1,38.1 90 top
U$2  [ORESAT-CARD-V1.3-BATTERY-V3.0]  0,0 0 top
X3  16MHZ-2.5x2mm  [CRYSTAL_2.5X2]  33.1,28.6 0 top